# Altium project BerndoKeyboard-Switchboard.PrjPcb (part 3 of 4)

## Sheet [04] - Keyboard Matrix 2.SchDoc: Keyboard Matrix 2
size A3; Date: N.A.; ApprovedBy: N.A.; CheckedBy: N.A.; Author: N.A.; CompanyName: Johannes Berndorfer; DrawnBy: JBE; Organization: N.A.; Address1: Konrad Grefe Gasse 22; Address2: 1230 Wien; Address3: AUSTRIA; Address4: N.A.; DocumentNumber: 4; Revision: A; SheetNumber: 4; SheetTotal: 8; ProjectTitle: Berndo Keyboard Switchboard PCB; Reviewer: -; Time: N.A.; ImagePath: N.A.; Application_BuildNumber: N.A.
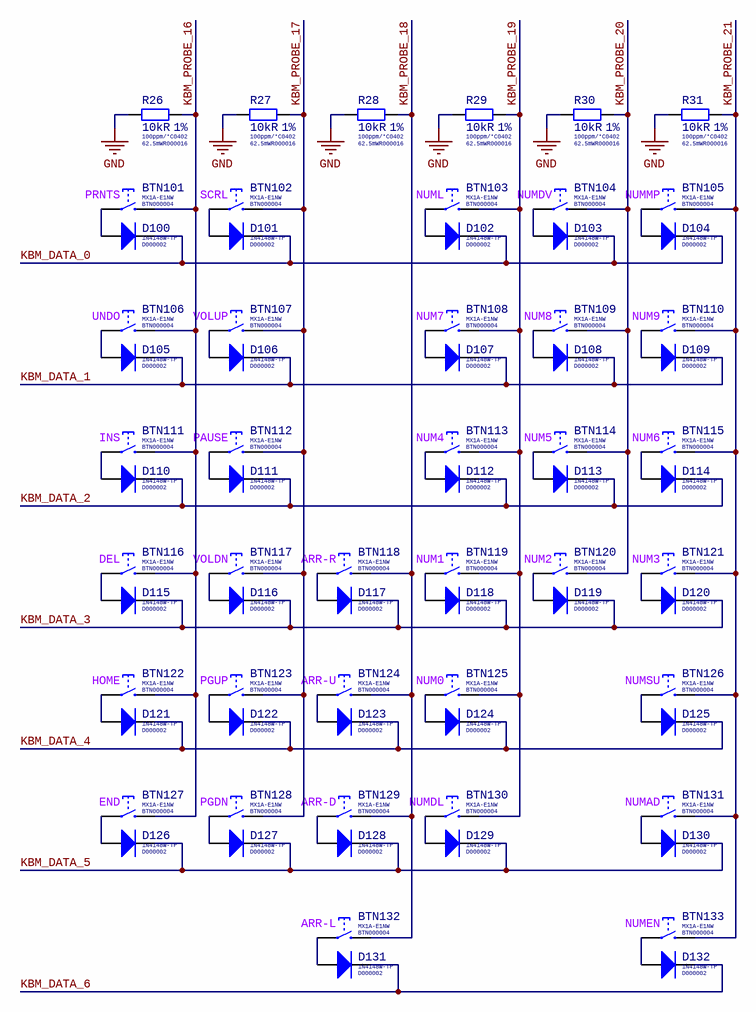
[diagram p3: [04] - Keyboard Matrix 2.SchDoc]

### Parts
BTN101  MX1A-E1NW  Internal Part Number: BTN000004  Key Function: PRNTS  [BTN-THT-MX-CHERRY]
BTN102  MX1A-E1NW  Internal Part Number: BTN000004  Key Function: SCRL  [BTN-THT-MX-CHERRY]
BTN103  MX1A-E1NW  Internal Part Number: BTN000004  Key Function: NUML  [BTN-THT-MX-CHERRY]
BTN104  MX1A-E1NW  Internal Part Number: BTN000004  Key Function: NUMDV  [BTN-THT-MX-CHERRY]
BTN105  MX1A-E1NW  Internal Part Number: BTN000004  Key Function: NUMMP  [BTN-THT-MX-CHERRY]
BTN106  MX1A-E1NW  Internal Part Number: BTN000004  Key Function: UNDO  [BTN-THT-MX-CHERRY]
BTN107  MX1A-E1NW  Internal Part Number: BTN000004  Key Function: VOLUP  [BTN-THT-MX-CHERRY]
BTN108  MX1A-E1NW  Internal Part Number: BTN000004  Key Function: NUM7  [BTN-THT-MX-CHERRY]
BTN109  MX1A-E1NW  Internal Part Number: BTN000004  Key Function: NUM8  [BTN-THT-MX-CHERRY]
BTN110  MX1A-E1NW  Internal Part Number: BTN000004  Key Function: NUM9  [BTN-THT-MX-CHERRY]
BTN111  MX1A-E1NW  Internal Part Number: BTN000004  Key Function: INS  [BTN-THT-MX-CHERRY]
BTN112  MX1A-E1NW  Internal Part Number: BTN000004  Key Function: PAUSE  [BTN-THT-MX-CHERRY]
BTN113  MX1A-E1NW  Internal Part Number: BTN000004  Key Function: NUM4  [BTN-THT-MX-CHERRY]
BTN114  MX1A-E1NW  Internal Part Number: BTN000004  Key Function: NUM5  [BTN-THT-MX-CHERRY]
BTN115  MX1A-E1NW  Internal Part Number: BTN000004  Key Function: NUM6  [BTN-THT-MX-CHERRY]
BTN116  MX1A-E1NW  Internal Part Number: BTN000004  Key Function: DEL  [BTN-THT-MX-CHERRY]
BTN117  MX1A-E1NW  Internal Part Number: BTN000004  Key Function: VOLDN  [BTN-THT-MX-CHERRY]
BTN118  MX1A-E1NW  Internal Part Number: BTN000004  Key Function: ARR-R  [BTN-THT-MX-CHERRY]
BTN119  MX1A-E1NW  Internal Part Number: BTN000004  Key Function: NUM1  [BTN-THT-MX-CHERRY]
BTN120  MX1A-E1NW  Internal Part Number: BTN000004  Key Function: NUM2  [BTN-THT-MX-CHERRY]
BTN121  MX1A-E1NW  Internal Part Number: BTN000004  Key Function: NUM3  [BTN-THT-MX-CHERRY]
BTN122  MX1A-E1NW  Internal Part Number: BTN000004  Key Function: HOME  [BTN-THT-MX-CHERRY]
BTN123  MX1A-E1NW  Internal Part Number: BTN000004  Key Function: PGUP  [BTN-THT-MX-CHERRY]
BTN124  MX1A-E1NW  Internal Part Number: BTN000004  Key Function: ARR-U  [BTN-THT-MX-CHERRY]
BTN125  MX1A-E1NW  Internal Part Number: BTN000004  Key Function: NUM0  [BTN-THT-MX-CHERRY]
BTN126  MX1A-E1NW  Internal Part Number: BTN000004  Key Function: NUMSU  [BTN-THT-MX-CHERRY]
BTN127  MX1A-E1NW  Internal Part Number: BTN000004  Key Function: END  [BTN-THT-MX-CHERRY]
BTN128  MX1A-E1NW  Internal Part Number: BTN000004  Key Function: PGDN  [BTN-THT-MX-CHERRY]
BTN129  MX1A-E1NW  Internal Part Number: BTN000004  Key Function: ARR-D  [BTN-THT-MX-CHERRY]
BTN130  MX1A-E1NW  Internal Part Number: BTN000004  Key Function: NUMDL  [BTN-THT-MX-CHERRY]
BTN131  MX1A-E1NW  Internal Part Number: BTN000004  Key Function: NUMAD  [BTN-THT-MX-CHERRY]
BTN132  MX1A-E1NW  Internal Part Number: BTN000004  Key Function: ARR-L  [BTN-THT-MX-CHERRY]
BTN133  MX1A-E1NW  Internal Part Number: BTN000004  Key Function: NUMEN  [BTN-THT-MX-CHERRY]
D100  1N4148W-TP  Internal Part Number: D000002  [D-SMD-SOD-123-MICRO-COMMERCIAL-COMPONENTS]
D101  1N4148W-TP  Internal Part Number: D000002  [D-SMD-SOD-123-MICRO-COMMERCIAL-COMPONENTS]
D102  1N4148W-TP  Internal Part Number: D000002  [D-SMD-SOD-123-MICRO-COMMERCIAL-COMPONENTS]
D103  1N4148W-TP  Internal Part Number: D000002  [D-SMD-SOD-123-MICRO-COMMERCIAL-COMPONENTS]
D104  1N4148W-TP  Internal Part Number: D000002  [D-SMD-SOD-123-MICRO-COMMERCIAL-COMPONENTS]
D105  1N4148W-TP  Internal Part Number: D000002  [D-SMD-SOD-123-MICRO-COMMERCIAL-COMPONENTS]
D106  1N4148W-TP  Internal Part Number: D000002  [D-SMD-SOD-123-MICRO-COMMERCIAL-COMPONENTS]
D107  1N4148W-TP  Internal Part Number: D000002  [D-SMD-SOD-123-MICRO-COMMERCIAL-COMPONENTS]
D108  1N4148W-TP  Internal Part Number: D000002  [D-SMD-SOD-123-MICRO-COMMERCIAL-COMPONENTS]
D109  1N4148W-TP  Internal Part Number: D000002  [D-SMD-SOD-123-MICRO-COMMERCIAL-COMPONENTS]
D110  1N4148W-TP  Internal Part Number: D000002  [D-SMD-SOD-123-MICRO-COMMERCIAL-COMPONENTS]
D111  1N4148W-TP  Internal Part Number: D000002  [D-SMD-SOD-123-MICRO-COMMERCIAL-COMPONENTS]
D112  1N4148W-TP  Internal Part Number: D000002  [D-SMD-SOD-123-MICRO-COMMERCIAL-COMPONENTS]
D113  1N4148W-TP  Internal Part Number: D000002  [D-SMD-SOD-123-MICRO-COMMERCIAL-COMPONENTS]
D114  1N4148W-TP  Internal Part Number: D000002  [D-SMD-SOD-123-MICRO-COMMERCIAL-COMPONENTS]
D115  1N4148W-TP  Internal Part Number: D000002  [D-SMD-SOD-123-MICRO-COMMERCIAL-COMPONENTS]
D116  1N4148W-TP  Internal Part Number: D000002  [D-SMD-SOD-123-MICRO-COMMERCIAL-COMPONENTS]
D117  1N4148W-TP  Internal Part Number: D000002  [D-SMD-SOD-123-MICRO-COMMERCIAL-COMPONENTS]
D118  1N4148W-TP  Internal Part Number: D000002  [D-SMD-SOD-123-MICRO-COMMERCIAL-COMPONENTS]
D119  1N4148W-TP  Internal Part Number: D000002  [D-SMD-SOD-123-MICRO-COMMERCIAL-COMPONENTS]
D120  1N4148W-TP  Internal Part Number: D000002  [D-SMD-SOD-123-MICRO-COMMERCIAL-COMPONENTS]
D121  1N4148W-TP  Internal Part Number: D000002  [D-SMD-SOD-123-MICRO-COMMERCIAL-COMPONENTS]
D122  1N4148W-TP  Internal Part Number: D000002  [D-SMD-SOD-123-MICRO-COMMERCIAL-COMPONENTS]
D123  1N4148W-TP  Internal Part Number: D000002  [D-SMD-SOD-123-MICRO-COMMERCIAL-COMPONENTS]
D124  1N4148W-TP  Internal Part Number: D000002  [D-SMD-SOD-123-MICRO-COMMERCIAL-COMPONENTS]
D125  1N4148W-TP  Internal Part Number: D000002  [D-SMD-SOD-123-MICRO-COMMERCIAL-COMPONENTS]
D126  1N4148W-TP  Internal Part Number: D000002  [D-SMD-SOD-123-MICRO-COMMERCIAL-COMPONENTS]
D127  1N4148W-TP  Internal Part Number: D000002  [D-SMD-SOD-123-MICRO-COMMERCIAL-COMPONENTS]
D128  1N4148W-TP  Internal Part Number: D000002  [D-SMD-SOD-123-MICRO-COMMERCIAL-COMPONENTS]
D129  1N4148W-TP  Internal Part Number: D000002  [D-SMD-SOD-123-MICRO-COMMERCIAL-COMPONENTS]
D130  1N4148W-TP  Internal Part Number: D000002  [D-SMD-SOD-123-MICRO-COMMERCIAL-COMPONENTS]
D131  1N4148W-TP  Internal Part Number: D000002  [D-SMD-SOD-123-MICRO-COMMERCIAL-COMPONENTS]
D132  1N4148W-TP  Internal Part Number: D000002  [D-SMD-SOD-123-MICRO-COMMERCIAL-COMPONENTS]
R26  Tolerance: 1%  Temperature Coefficient: 100ppm/°C  Resistance: 10kR  Power Rating: 62.5mW  Case Code (Imperial): 0402  Internal Part Number: R000016  [RES-SMD-0402-0.4MM-IPC-MED]  (hidden comment: 10kR 1%)
R27  Tolerance: 1%  Temperature Coefficient: 100ppm/°C  Resistance: 10kR  Power Rating: 62.5mW  Case Code (Imperial): 0402  Internal Part Number: R000016  [RES-SMD-0402-0.4MM-IPC-MED]  (hidden comment: 10kR 1%)
R28  Tolerance: 1%  Temperature Coefficient: 100ppm/°C  Resistance: 10kR  Power Rating: 62.5mW  Case Code (Imperial): 0402  Internal Part Number: R000016  [RES-SMD-0402-0.4MM-IPC-MED]  (hidden comment: 10kR 1%)
R29  Tolerance: 1%  Temperature Coefficient: 100ppm/°C  Resistance: 10kR  Power Rating: 62.5mW  Case Code (Imperial): 0402  Internal Part Number: R000016  [RES-SMD-0402-0.4MM-IPC-MED]  (hidden comment: 10kR 1%)
R30  Tolerance: 1%  Temperature Coefficient: 100ppm/°C  Resistance: 10kR  Power Rating: 62.5mW  Case Code (Imperial): 0402  Internal Part Number: R000016  [RES-SMD-0402-0.4MM-IPC-MED]  (hidden comment: 10kR 1%)
R31  Tolerance: 1%  Temperature Coefficient: 100ppm/°C  Resistance: 10kR  Power Rating: 62.5mW  Case Code (Imperial): 0402  Internal Part Number: R000016  [RES-SMD-0402-0.4MM-IPC-MED]  (hidden comment: 10kR 1%)

### Nets
GND: R26.1 R27.1 R28.1 R29.1 R30.1 R31.1
KBM_DATA_0: D100.1 D101.1 D102.1 D103.1 D104.1
KBM_DATA_1: D105.1 D106.1 D107.1 D108.1 D109.1
KBM_DATA_2: D110.1 D111.1 D112.1 D113.1 D114.1
KBM_DATA_3: D115.1 D116.1 D117.1 D118.1 D119.1 D120.1
KBM_DATA_4: D121.1 D122.1 D123.1 D124.1 D125.1
KBM_DATA_5: D126.1 D127.1 D128.1 D129.1 D130.1
KBM_DATA_6: D131.1 D132.1
KBM_PROBE_16: BTN101.2 BTN106.2 BTN111.2 BTN116.2 BTN122.2 BTN127.2 R26.2
KBM_PROBE_17: BTN102.2 BTN107.2 BTN112.2 BTN117.2 BTN123.2 BTN128.2 R27.2
KBM_PROBE_18: BTN118.2 BTN124.2 BTN129.2 BTN132.2 R28.2
KBM_PROBE_19: BTN103.2 BTN108.2 BTN113.2 BTN119.2 BTN125.2 BTN130.2 R29.2
KBM_PROBE_20: BTN104.2 BTN109.2 BTN114.2 BTN120.2 R30.2
KBM_PROBE_21: BTN105.2 BTN110.2 BTN115.2 BTN121.2 BTN126.2 BTN131.2 BTN133.2 R31.2
NetBTN101_1: BTN101.1 D100.2
NetBTN102_1: BTN102.1 D101.2
NetBTN103_1: BTN103.1 D102.2
NetBTN104_1: BTN104.1 D103.2
NetBTN105_1: BTN105.1 D104.2
NetBTN106_1: BTN106.1 D105.2
NetBTN107_1: BTN107.1 D106.2
NetBTN108_1: BTN108.1 D107.2
NetBTN109_1: BTN109.1 D108.2
NetBTN110_1: BTN110.1 D109.2
NetBTN111_1: BTN111.1 D110.2
NetBTN112_1: BTN112.1 D111.2
NetBTN113_1: BTN113.1 D112.2
NetBTN114_1: BTN114.1 D113.2
NetBTN115_1: BTN115.1 D114.2
NetBTN116_1: BTN116.1 D115.2
NetBTN117_1: BTN117.1 D116.2
NetBTN118_1: BTN118.1 D117.2
NetBTN119_1: BTN119.1 D118.2
NetBTN120_1: BTN120.1 D119.2
NetBTN121_1: BTN121.1 D120.2
NetBTN122_1: BTN122.1 D121.2
NetBTN123_1: BTN123.1 D122.2
NetBTN124_1: BTN124.1 D123.2
NetBTN125_1: BTN125.1 D124.2
NetBTN126_1: BTN126.1 D125.2
NetBTN127_1: BTN127.1 D126.2
NetBTN128_1: BTN128.1 D127.2
NetBTN129_1: BTN129.1 D128.2
NetBTN130_1: BTN130.1 D129.2
NetBTN131_1: BTN131.1 D130.2
NetBTN132_1: BTN132.1 D131.2
NetBTN133_1: BTN133.1 D132.2

### Notes on the sheet
- Title:
- Project:
- Document Nr.:
- Revision:
- Date:
- Drawn By:
- Time:
- Reviewed By:
- Sheet
- of
- Size:
- A3
- Variant:
- File:

### Library data of the parts
BTN101-BTN133 = MX1A-E1NW: BTN CHERRY MX BLUE SPST-NO 12V 10mA; Mechanical Life: 20000000Cycles; Throw Configuration: SPST; Contact Resistance: 200mR; Operating Force: 0.5N; Switch Function: Off-Mom; Row Spacing: 2.54mm; Actuator Length: 3.6mm; Supplier 1: Digi-Key; Manufacturer: Cherry; Manufacturer Part Number: MX1A-E1NW; Stock 1: 3965; Pricing 1: 1 = 0,90000, 10 = 0,84000, 25 = 0,80000, 50 = 0,76000, 100 = 0,74000, 250 = 0,72000, 500 = 0,68000, 1000 = 0,64000, 5000 = 0,54000 (USD); RoHS: Yes; Mount: Through Hole; Contact Plating: Gold; Contact Material: Gold,Silver; Number of Terminals: 2; Housing Material: Thermoplastic; Min Operating Temperature: -10°C; Max Operating Temperature: 70°C; Voltage Rating (AC): 12V; Voltage Rating (DC): 12V; Packaging: Bulk; Current Rating: 10mA; Max Voltage Rating (AC): 12V; Max Voltage Rating (DC): 12V; Max Current Rating: 10mA; Package Quantity: 1000; Termination: PC Pin; Electrical Life: 20000000Cycles; Orientation: Straight; Contact Current Rating: 10mA; Length: 15.6mm; Terminal Pitch: 6.35mm; Width: 15.6mm; Lead Free: Lead Free; Flammability Rating: UL94 HB; ComponentLink1URL: https://datasheet.ciiva.com/2869/mx20series-2869568.pdf?src-supplier=Digi-Key; ComponentLink1Description: https://datasheet.ciiva.com/2869/mx20series-2869568.pdf?src-supplier=Digi-Key; ComponentLink2URL: https://datasheet.ciiva.com/5259/mx-cat-216303-5259204.pdf?src-supplier=Mouser; ComponentLink2Description: https://datasheet.ciiva.com/5259/mx-cat-216303-5259204.pdf?src-supplier=Mouser; Supplier Part Number 1: CH197-ND
D100-D132 = 1N4148W-TP: DIODE GEN-PURP 100V 150mA 1V25@150mA SMD SOD-23; Manufacturer: MCC; Max Surge Current: 2A; Forward Voltage: 1V; Recovery Time: 4ns; Max Reverse Leakage Current: 5uA; Power Dissipation: 400mW; Max Forward Surge Current (Ifsm): 1A; Element Configuration: Single; Polarity: Standard; Capacitance: 4pF; Supplier 1: Digi-Key; Manufacturer Part Number: 1N4148W-TP; Stock 1: 1077433; Pricing 1: 1 = 0,13000, 10 = 0,11900, 100 = 0,06480, 500 = 0,03986, 1000 = 0,02718 (USD); RoHS: Yes; Mount: Surface Mount; Number of Pins: 2; Min Operating Temperature: -65°C; Max Operating Temperature: 150°C; Packaging: Tape and Reel; Forward Current: 150mA; Package Quantity: 3000; Average Rectified Current: 150mA; Reverse Recovery Time: 4ns; Max Repetitive Reverse Voltage (Vrrm): 100V; Peak Non-Repetitive Surge Current: 2A; Voltage Rating (DC): 100V; Current Rating: 150mA; Output Current: 150mA; Max Reverse Voltage (DC): 100V; Length: 2.85mm; Height: 1.2mm; Width: 1.8mm; Radiation Hardening: No; REACH SVHC: Unknown; Lead Free: Lead Free; ComponentLink1URL: https://datasheet.ciiva.com/1243/1684829-1243908.pdf?src-supplier=Newark; ComponentLink1Description: https://datasheet.ciiva.com/1243/1684829-1243908.pdf?src-supplier=Newark; ComponentLink2URL: https://datasheet.ciiva.com/16836/1n4148wsod123-16836277.pdf?src-supplier=Future+Electronics; ComponentLink2Description: https://datasheet.ciiva.com/16836/1n4148wsod123-16836277.pdf?src-supplier=Future+Electronics; ComponentLink3URL: https://datasheet.ciiva.com/4435/1n4148wsod123-48460-4435223.pdf?src-supplier=Mouser; ComponentLink3Description: https://datasheet.ciiva.com/4435/1n4148wsod123-48460-4435223.pdf?src-supplier=Mouser; ComponentLink4URL: https://datasheet.ciiva.com/14557/70055519-14557767.pdf?src-supplier=Allied+Electronics; ComponentLink4Description: https://datasheet.ciiva.com/14557/70055519-14557767.pdf?src-supplier=Allied+Electronics; ComponentLink5URL: https://datasheet.ciiva.com/911/1n4148wsod123-911676.pdf?src-supplier=Digi-Key; ComponentLink5Description: https://datasheet.ciiva.com/911/1n4148wsod123-911676.pdf?src-supplier=Digi-Key; ComponentLink6URL: https://datasheet.ciiva.com/7622/1684829-7622556.pdf?src-supplier=Element14; ComponentLink6Description: https://datasheet.ciiva.com/7622/1684829-7622556.pdf?src-supplier=Element14; ComponentLink7URL: https://datasheet.ciiva.com/911/1n4148wsod123-911677.pdf?src-supplier=Digi-Key; ComponentLink7Description: https://datasheet.ciiva.com/911/1n4148wsod123-911677.pdf?src-supplier=Digi-Key; ComponentLink8URL: https://datasheet.ciiva.com/911/1n4148wsod123-911678.pdf?src-supplier=Digi-Key; ComponentLink8Description: https://datasheet.ciiva.com/911/1n4148wsod123-911678.pdf?src-supplier=Digi-Key; ComponentLink9URL: https://datasheet.ciiva.com/22747/1684829-22747439.pdf?src-supplier=Element14; ComponentLink9Description: https://datasheet.ciiva.com/22747/1684829-22747439.pdf?src-supplier=Element14; Supplier Part Number 1: 1N4148WTPMSCT-ND
R26-R31 = RC0402FR-0710KL: RES 10K 1% 1/16W SMD 0402 YAEGO; Manufacturer: Yageo; Voltage Rating: 50V; Manufacturer Part Number: RC0402FR-0710KL; RoHS: Yes; Case/Package: 0402; Number of Pins: 2; Case Code (Metric): 1005; Min Operating Temperature: -55°C; Max Operating Temperature: 155°C; Packaging: Tape and Reel; Composition: Thick Film; Voltage Rating (DC): 50V; Termination: SMD/SMT; Military Standard: Not; Working Voltage: 50V; Number of Terminations: 2; Length: 1mm; Height: 0.32mm; Width: 0.5mm; Depth: 0.5mm; Lead Pitch: 0.2mm; REACH SVHC: No SVHC; Lead Free: Lead Free; ComponentLink1URL: https://datasheet.ciiva.com/7660/38568-7660787.pdf?src-supplier=Element14; ComponentLink1Description: https://datasheet.ciiva.com/7660/38568-7660787.pdf?src-supplier=Element14; ComponentLink2URL: https://datasheet.ciiva.com/7849/1784430-7849813.pdf?src-supplier=Element14; ComponentLink2Description: https://datasheet.ciiva.com/7849/1784430-7849813.pdf?src-supplier=Element14; ComponentLink3URL: https://datasheet.ciiva.com/7849/1686128-7849814.pdf?src-supplier=Element14; ComponentLink3Description: https://datasheet.ciiva.com/7849/1686128-7849814.pdf?src-supplier=Element14; ComponentLink4URL: https://datasheet.ciiva.com/7849/1784430-7849815.pdf?src-supplier=Element14; ComponentLink4Description: https://datasheet.ciiva.com/7849/1784430-7849815.pdf?src-supplier=Element14; ComponentLink5URL: https://datasheet.ciiva.com/22747/1018594-22747512.pdf?src-supplier=Element14; ComponentLink5Description: https://datasheet.ciiva.com/22747/1018594-22747512.pdf?src-supplier=Element14; ComponentLink6URL: https://datasheet.ciiva.com/12667/pyu-rc0402-51-rohs-l-6-r-12667067.pdf?src-supplier=Mouser; ComponentLink6Description: https://datasheet.ciiva.com/12667/pyu-rc0402-51-rohs-l-6-r-12667067.pdf?src-supplier=Mouser; ComponentLink7URL: https://datasheet.ciiva.com/7983/1018594-7983486.pdf?src-supplier=Element14; ComponentLink7Description: https://datasheet.ciiva.com/7983/1018594-7983486.pdf?src-supplier=Element14; Package Quantity: 10000; ComponentLink8URL: https://datasheet.ciiva.com/11819/0900766b80c66297-11819487.pdf?src-supplier=RSComponents; ComponentLink8Description: https://datasheet.ciiva.com/11819/0900766b80c66297-11819487.pdf?src-supplier=RSComponents; ComponentLink9URL: https://datasheet.ciiva.com/15189/getdatasheetpartid-329253-15189431.pdf?src-supplier=Verical; ComponentLink9Description: https://datasheet.ciiva.com/15189/getdatasheetpartid-329253-15189431.pdf?src-supplier=Verical; ComponentLink10URL: https://datasheet.ciiva.com/24070/pyu-rc0402-51-rohs-l-6-r-8721-24070077.pdf?src-supplier=Mouser; ComponentLink10Description: https://datasheet.ciiva.com/24070/pyu-rc0402-51-rohs-l-6-r-8721-24070077.pdf?src-supplier=Mouser; ComponentLink11URL: https://datasheet.ciiva.com/7849/1018594-7849966.pdf?src-supplier=Element14; ComponentLink11Description: https://datasheet.ciiva.com/7849/1018594-7849966.pdf?src-supplier=Element14; ComponentLink12URL: https://datasheet.ciiva.com/7849/1018594-7849967.pdf?src-supplier=Element14; ComponentLink12Description: https://datasheet.ciiva.com/7849/1018594-7849967.pdf?src-supplier=Element14; ComponentLink13URL: https://datasheet.ciiva.com/17070/pyu-rc0402-51-rohs-l-6-r-17070335.pdf?src-supplier=Future+Electronics; ComponentLink13Description: https://datasheet.ciiva.com/17070/pyu-rc0402-51-rohs-l-6-r-17070335.pdf?src-supplier=Future+Electronics; Supplier 1: Digi-Key; Stock 1: 86154015; Pricing 1: 1 = 0,10000, 10 = 0,01600, 100 = 0,00670, 1000 = 0,00301, 2500 = 0,00261, 5000 = 0,00215 (USD); Supplier Part Number 1: 311-10.0KLRCT-ND

## Sheet [05] - Probe Line IO Expanders.SchDoc: Probe Line IO Expanders
size A3; Date: N.A.; ApprovedBy: N.A.; CheckedBy: N.A.; Author: N.A.; CompanyName: Johannes Berndorfer; DrawnBy: JBE; Organization: N.A.; Address1: Konrad Grefe Gasse 22; Address2: 1230 Wien; Address3: AUSTRIA; Address4: N.A.; DocumentNumber: 5; Revision: A; SheetNumber: 5; SheetTotal: 8; ProjectTitle: Berndo Keyboard Switchboard PCB; Reviewer: -; Time: N.A.; ImagePath: N.A.; Application_BuildNumber: N.A.
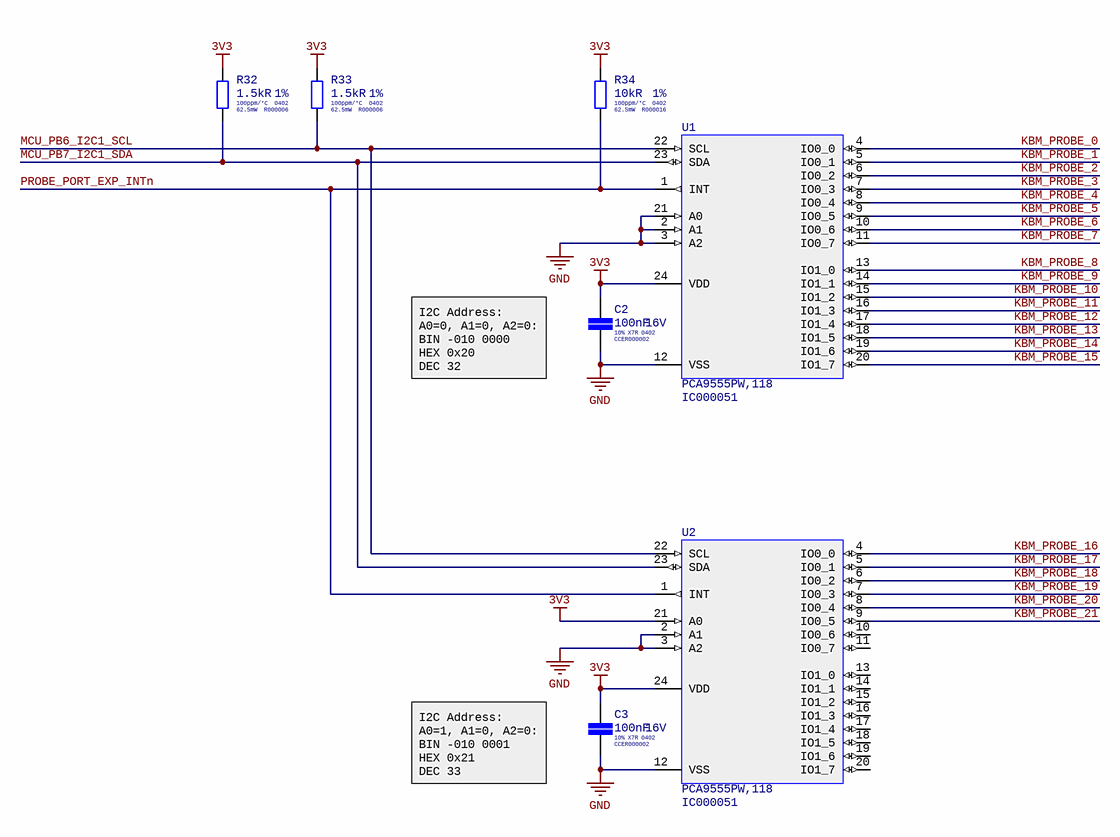
[diagram p4: [05] - Probe Line IO Expanders.SchDoc]

### Parts
C2  Tolerance: 10%  Internal Part Number: CCER000002  Voltage Rating (DC): 16V  Dielectric: X7R  Case/Package: 0402  Capacitance: 100nF  [CAP-SMD-0402-0.55MM-IPC-MED]  (hidden comment: 100nF 16V)
C3  Tolerance: 10%  Internal Part Number: CCER000002  Voltage Rating (DC): 16V  Dielectric: X7R  Case/Package: 0402  Capacitance: 100nF  [CAP-SMD-0402-0.55MM-IPC-MED]  (hidden comment: 100nF 16V)
R32  Temperature Coefficient: 100ppm/°C  Tolerance: 1%  Resistance: 1.5kR  Max Power Dissipation: 62.5mW  Case/Package: 0402  Internal Part Number: R000006  [RES-SMD-0402-0.4MM-IPC-MED]  (hidden comment: 1.5kR 1%)
R33  Temperature Coefficient: 100ppm/°C  Tolerance: 1%  Resistance: 1.5kR  Max Power Dissipation: 62.5mW  Case/Package: 0402  Internal Part Number: R000006  [RES-SMD-0402-0.4MM-IPC-MED]  (hidden comment: 1.5kR 1%)
R34  Tolerance: 1%  Temperature Coefficient: 100ppm/°C  Resistance: 10kR  Power Rating: 62.5mW  Case Code (Imperial): 0402  Internal Part Number: R000016  [RES-SMD-0402-0.4MM-IPC-MED]  (hidden comment: 10kR 1%)
U1  PCA9555PW,118  Internal Part Number: IC000051  [TSSOP-24-H1.1MM-P0.65MM-NXP]
U2  PCA9555PW,118  Internal Part Number: IC000051  [TSSOP-24-H1.1MM-P0.65MM-NXP]

### Nets
3V3: C2.1 C3.1 R32.1 R33.1 R34.1 U1.24(VDD) U2.21(A0) U2.24(VDD)
GND: C2.2 C3.2 U1.2(A1) U1.3(A2) U1.12(VSS) U1.21(A0) U2.2(A1) U2.3(A2) U2.12(VSS)
KBM_PROBE_0: U1.4(IO0_0)
KBM_PROBE_1: U1.5(IO0_1)
KBM_PROBE_2: U1.6(IO0_2)
KBM_PROBE_3: U1.7(IO0_3)
KBM_PROBE_4: U1.8(IO0_4)
KBM_PROBE_5: U1.9(IO0_5)
KBM_PROBE_6: U1.10(IO0_6)
KBM_PROBE_7: U1.11(IO0_7)
KBM_PROBE_8: U1.13(IO1_0)
KBM_PROBE_9: U1.14(IO1_1)
KBM_PROBE_10: U1.15(IO1_2)
KBM_PROBE_11: U1.16(IO1_3)
KBM_PROBE_12: U1.17(IO1_4)
KBM_PROBE_13: U1.18(IO1_5)
KBM_PROBE_14: U1.19(IO1_6)
KBM_PROBE_15: U1.20(IO1_7)
KBM_PROBE_16: U2.4(IO0_0)
KBM_PROBE_17: U2.5(IO0_1)
KBM_PROBE_18: U2.6(IO0_2)
KBM_PROBE_19: U2.7(IO0_3)
KBM_PROBE_20: U2.8(IO0_4)
KBM_PROBE_21: U2.9(IO0_5)
MCU_PB6_I2C1_SCL: R33.2 U1.22(SCL) U2.22(SCL)
MCU_PB7_I2C1_SDA: R32.2 U1.23(SDA) U2.23(SDA)
PROBE_PORT_EXP_INTn: R34.2 U1.1(INT) U2.1(INT)

Not connected (* = marked no-connect by the designer): U2 10(IO0_6) 11(IO0_7) 13(IO1_0) 14(IO1_1) 15(IO1_2) 16(IO1_3) 17(IO1_4) 18(IO1_5) 19(IO1_6) 20(IO1_7)

### Notes on the sheet
- I2C Address:
  A0=0, A1=0, A2=0:
  BIN -010 0000
  HEX 0x20
  DEC 32
- I2C Address:
  A0=1, A1=0, A2=0:
  BIN -010 0001
  HEX 0x21
  DEC 33
- Title:
- Project:
- Document Nr.:
- Revision:
- Date:
- Drawn By:
- Time:
- Reviewed By:
- Sheet
- of
- Size:
- A3
- Variant:
- File:

### Library data of the parts
C2 C3 = CL05B104KO5NNNC: CAP CER 100N 16V X7R 10% SMD 0402 125C SAMSUNG; Material: Ceramic; Supplier 1: Digi-Key; Manufacturer 1: Samsung; Manufacturer Part Number 1: CL05B104KO5NNNC; Stock 1: 53930414; Pricing 1: 1=0,10000, 10=0,02400, 100=0,01070, 500=0,00766, 1000=0,00602, 2500=0,00548, 5000=0,00504 (USD); RoHS: Yes; Mount: Surface Mount; Case Code (Metric): 1005; Case Code (Imperial): 0402; Contact Plating: Tin; Min Operating Temperature: -55°C; Max Operating Temperature: 125°C; Package Quantity: 1; Packaging: Tape and Reel; Voltage Rating: 16V; Voltage: 16V; Length: 1mm; Height: 0.5mm; Width: 0.02inch; Thickness: 0.022inch; Depth: 0.5mm; Radiation Hardening: No; Lead Free: Lead Free; ComponentLink1URL: https://datasheet.ciiva.com/26920/getdatasheetpartid-359683-26920169.pdf?src-supplier=Verical; ComponentLink1Description: https://datasheet.ciiva.com/26920/getdatasheetpartid-359683-26920169.pdf?src-supplier=Verical; ComponentLink2URL: https://datasheet.ciiva.com/29198/458718-da-01-en-vs-kondensator-0402-29198423.pdf?src-supplier=Conrad; ComponentLink2Description: https://datasheet.ciiva.com/29198/458718-da-01-en-vs-kondensator-0402-29198423.pdf?src-supplier=Conrad; ComponentLink3URL: https://datasheet.ciiva.com/16208/cl05b104kq5nnnc-16208343.pdf?src-supplier=Future+Electronics; ComponentLink3Description: https://datasheet.ciiva.com/16208/cl05b104kq5nnnc-16208343.pdf?src-supplier=Future+Electronics; ComponentLink4URL: https://datasheet.ciiva.com/26309/mlcc-catalogdownload2013-eng-26309003.pdf?src-supplier=Distrelec; ComponentLink4Description: https://datasheet.ciiva.com/26309/mlcc-catalogdownload2013-eng-26309003.pdf?src-supplier=Distrelec; Supplier Part Number 1: 1276-1001-6-ND
R32 R33 = RC0402FR-071K5L: RES 1K5 1% 1/16W SMD 0402 YAEGO; Manufacturer: Yageo; Voltage Rating: 50V; Supplier 1: Digi-Key; Manufacturer Part Number: RC0402FR-071K5L; Stock 1: 9091318; Pricing 1: 1 = 0,10000, 10 = 0,01600, 100 = 0,00640, 1000 = 0,00286, 2500 = 0,00248, 5000 = 0,00205 (USD); RoHS: Yes; Case Code (Metric): 1005; Case Code (Imperial): 0402; Min Operating Temperature: -55°C; Max Operating Temperature: 155°C; Package Quantity: 1; Power Rating: 62.5mW; Packaging: Tape and Reel; Composition: Thick Film; Number of Terminations: 2; Termination: SMD/SMT; Military Standard: Not; Features: Moisture Resistant; Length: 1mm; Height: 0.016inch; Width: 0.02inch; Depth: 0.5mm; REACH SVHC: No SVHC; Lead Free: Lead Free; ComponentLink1URL: https://datasheet.ciiva.com/11808/0900766b80c66297-11808238.pdf?src-supplier=RSComponents; ComponentLink1Description: https://datasheet.ciiva.com/11808/0900766b80c66297-11808238.pdf?src-supplier=RSComponents; ComponentLink2URL: https://datasheet.ciiva.com/2453/pyu-r-int-thick-7-2453440.pdf?src-supplier=Digi-Key; ComponentLink2Description: https://datasheet.ciiva.com/2453/pyu-r-int-thick-7-2453440.pdf?src-supplier=Digi-Key; ComponentLink3URL: https://datasheet.ciiva.com/2453/pyu-r-int-thick-7-2453441.pdf?src-supplier=Digi-Key; ComponentLink3Description: https://datasheet.ciiva.com/2453/pyu-r-int-thick-7-2453441.pdf?src-supplier=Digi-Key; ComponentLink4URL: https://datasheet.ciiva.com/46394/1018594-46394950.pdf?src-supplier=Element14; ComponentLink4Description: https://datasheet.ciiva.com/46394/1018594-46394950.pdf?src-supplier=Element14; ComponentLink5URL: https://datasheet.ciiva.com/7849/1018594-7849864.pdf?src-supplier=Element14; ComponentLink5Description: https://datasheet.ciiva.com/7849/1018594-7849864.pdf?src-supplier=Element14; ComponentLink6URL: https://datasheet.ciiva.com/15189/getdatasheetpartid-323992-15189370.pdf?src-supplier=Verical; ComponentLink6Description: https://datasheet.ciiva.com/15189/getdatasheetpartid-323992-15189370.pdf?src-supplier=Verical; ComponentLink7URL: https://datasheet.ciiva.com/7849/1018594-7849863.pdf?src-supplier=Element14; ComponentLink7Description: https://datasheet.ciiva.com/7849/1018594-7849863.pdf?src-supplier=Element14; ComponentLink8URL: https://datasheet.ciiva.com/12558/pyu-rc0402-51-rohs-l-6-r-8721-12558542.pdf?src-supplier=Mouser; ComponentLink8Description: https://datasheet.ciiva.com/12558/pyu-rc0402-51-rohs-l-6-r-8721-12558542.pdf?src-supplier=Mouser; ComponentLink9URL: https://datasheet.ciiva.com/2453/pyu-r-int-thick-7-2453439.pdf?src-supplier=Digi-Key; ComponentLink9Description: https://datasheet.ciiva.com/2453/pyu-r-int-thick-7-2453439.pdf?src-supplier=Digi-Key; Supplier Part Number 1: 311-1.50KLRCT-ND
R34 = RC0402FR-0710KL: as R26 on sheet [04] - Keyboard Matrix 2; Manufacturer Part Number: RC0402FR-0710KL; RoHS: Yes; Case/Package: 0402; Number of Pins: 2; Case Code (Metric): 1005; Min Operating Temperature: -55°C; Max Operating Temperature: 155°C; Packaging: Tape and Reel; Composition: Thick Film; Voltage Rating (DC): 50V; Termination: SMD/SMT; Military Standard: Not; Working Voltage: 50V; Number of Terminations: 2; Length: 1mm; Height: 0.32mm; Width: 0.5mm; Depth: 0.5mm; Lead Pitch: 0.2mm; REACH SVHC: No SVHC; Lead Free: Lead Free; ComponentLink1URL: https://datasheet.ciiva.com/7660/38568-7660787.pdf?src-supplier=Element14; ComponentLink1Description: https://datasheet.ciiva.com/7660/38568-7660787.pdf?src-supplier=Element14; ComponentLink2URL: https://datasheet.ciiva.com/7849/1784430-7849813.pdf?src-supplier=Element14; ComponentLink2Description: https://datasheet.ciiva.com/7849/1784430-7849813.pdf?src-supplier=Element14; ComponentLink3URL: https://datasheet.ciiva.com/7849/1686128-7849814.pdf?src-supplier=Element14; ComponentLink3Description: https://datasheet.ciiva.com/7849/1686128-7849814.pdf?src-supplier=Element14; ComponentLink4URL: https://datasheet.ciiva.com/7849/1784430-7849815.pdf?src-supplier=Element14; ComponentLink4Description: https://datasheet.ciiva.com/7849/1784430-7849815.pdf?src-supplier=Element14; ComponentLink5URL: https://datasheet.ciiva.com/22747/1018594-22747512.pdf?src-supplier=Element14; ComponentLink5Description: https://datasheet.ciiva.com/22747/1018594-22747512.pdf?src-supplier=Element14; ComponentLink6URL: https://datasheet.ciiva.com/12667/pyu-rc0402-51-rohs-l-6-r-12667067.pdf?src-supplier=Mouser; ComponentLink6Description: https://datasheet.ciiva.com/12667/pyu-rc0402-51-rohs-l-6-r-12667067.pdf?src-supplier=Mouser; ComponentLink7URL: https://datasheet.ciiva.com/7983/1018594-7983486.pdf?src-supplier=Element14; ComponentLink7Description: https://datasheet.ciiva.com/7983/1018594-7983486.pdf?src-supplier=Element14; Package Quantity: 10000; ComponentLink8URL: https://datasheet.ciiva.com/11819/0900766b80c66297-11819487.pdf?src-supplier=RSComponents; ComponentLink8Description: https://datasheet.ciiva.com/11819/0900766b80c66297-11819487.pdf?src-supplier=RSComponents; ComponentLink9URL: https://datasheet.ciiva.com/15189/getdatasheetpartid-329253-15189431.pdf?src-supplier=Verical; ComponentLink9Description: https://datasheet.ciiva.com/15189/getdatasheetpartid-329253-15189431.pdf?src-supplier=Verical; ComponentLink10URL: https://datasheet.ciiva.com/24070/pyu-rc0402-51-rohs-l-6-r-8721-24070077.pdf?src-supplier=Mouser; ComponentLink10Description: https://datasheet.ciiva.com/24070/pyu-rc0402-51-rohs-l-6-r-8721-24070077.pdf?src-supplier=Mouser; ComponentLink11URL: https://datasheet.ciiva.com/7849/1018594-7849966.pdf?src-supplier=Element14; ComponentLink11Description: https://datasheet.ciiva.com/7849/1018594-7849966.pdf?src-supplier=Element14; ComponentLink12URL: https://datasheet.ciiva.com/7849/1018594-7849967.pdf?src-supplier=Element14; ComponentLink12Description: https://datasheet.ciiva.com/7849/1018594-7849967.pdf?src-supplier=Element14; ComponentLink13URL: https://datasheet.ciiva.com/17070/pyu-rc0402-51-rohs-l-6-r-17070335.pdf?src-supplier=Future+Electronics; ComponentLink13Description: https://datasheet.ciiva.com/17070/pyu-rc0402-51-rohs-l-6-r-17070335.pdf?src-supplier=Future+Electronics; Supplier 1: Digi-Key; Stock 1: 86154015; Pricing 1: 1 = 0,10000, 10 = 0,01600, 100 = 0,00670, 1000 = 0,00301, 2500 = 0,00261, 5000 = 0,00215 (USD); Supplier Part Number 1: 311-10.0KLRCT-ND
U1 U2 = PCA9555PW,118: IC I/O EXPANDER I2C 16B 24TSSOP; Manufacturer: NXP Semiconductors; Number of I/Os: 16; Interface: I2C,SMBus,Serial; Output Current: 50mA; Nominal Supply Current: 160mA; Min Supply Voltage: 2.3V; Max Supply Voltage: 5.5V; Operating Supply Current: 135uA; Max Power Dissipation: 200mW; Frequency: 400kHz; Output Voltage: 4.1V; Supplier 1: Digi-Key; Manufacturer Part Number: PCA9555PW,118; Stock 1: 10944; Pricing 1: 1 = 1,70000, 10 = 1,52900, 100 = 1,22860, 500 = 1,00940, 1000 = 0,83636 (USD); RoHS: Yes; Mount: Surface Mount; Case/Package: TSSOP; Number of Pins: 24; Min Operating Temperature: -40°C; Max Operating Temperature: 85°C; Packaging: Tape and Reel; Package Quantity: 1; Max Frequency: 400kHz; Radiation Hardening: No; REACH SVHC: No SVHC; Lead Free: Lead Free; ComponentLink1URL: https://datasheet.ciiva.com/15134/getdatasheetpartid-148982-15134333.pdf?src-supplier=Verical; ComponentLink1Description: https://datasheet.ciiva.com/15134/getdatasheetpartid-148982-15134333.pdf?src-supplier=Verical; ComponentLink2URL: https://datasheet.ciiva.com/1780/pca9555-1780068.pdf?src-supplier=Digi-Key; ComponentLink2Description: https://datasheet.ciiva.com/1780/pca9555-1780068.pdf?src-supplier=Digi-Key; ComponentLink3URL: https://datasheet.ciiva.com/1504/1090559-1504901.pdf?src-supplier=Farnell; ComponentLink3Description: https://datasheet.ciiva.com/1504/1090559-1504901.pdf?src-supplier=Farnell; ComponentLink4URL: https://datasheet.ciiva.com/1780/pca9555-1780069.pdf?src-supplier=Digi-Key; ComponentLink4Description: https://datasheet.ciiva.com/1780/pca9555-1780069.pdf?src-supplier=Digi-Key; ComponentLink5URL: https://datasheet.ciiva.com/1780/pca9555-1780070.pdf?src-supplier=Digi-Key; ComponentLink5Description: https://datasheet.ciiva.com/1780/pca9555-1780070.pdf?src-supplier=Digi-Key; ComponentLink6URL: https://datasheet.ciiva.com/1495/1090559-1495945.pdf?src-supplier=Element14; ComponentLink6Description: https://datasheet.ciiva.com/1495/1090559-1495945.pdf?src-supplier=Element14; ComponentLink7URL: https://datasheet.ciiva.com/8122/pca9555-8122281.pdf?src-supplier=Avnet; ComponentLink7Description: https://datasheet.ciiva.com/8122/pca9555-8122281.pdf?src-supplier=Avnet; ComponentLink8URL: https://datasheet.ciiva.com/46381/1090559-46381881.pdf?src-supplier=Element14; ComponentLink8Description: https://datasheet.ciiva.com/46381/1090559-46381881.pdf?src-supplier=Element14; ComponentLink9URL: https://datasheet.ciiva.com/4826/pca9555-4826810.pdf?src-supplier=Mouser; ComponentLink9Description: https://datasheet.ciiva.com/4826/pca9555-4826810.pdf?src-supplier=Mouser; Supplier Part Number 1: 568-1058-1-ND

## Sheet [06] - Backlight LEDs.SchDoc: Backlight LEDs
size A3; Date: N.A.; ApprovedBy: N.A.; CheckedBy: N.A.; Author: N.A.; CompanyName: Johannes Berndorfer; DrawnBy: JBE; Organization: N.A.; Address1: Konrad Grefe Gasse 22; Address2: 1230 Wien; Address3: AUSTRIA; Address4: N.A.; DocumentNumber: 6; Revision: A; SheetNumber: 6; SheetTotal: 8; ProjectTitle: Berndo Keyboard Switchboard PCB; Reviewer: -; Time: N.A.; ImagePath: N.A.; Application_BuildNumber: N.A.
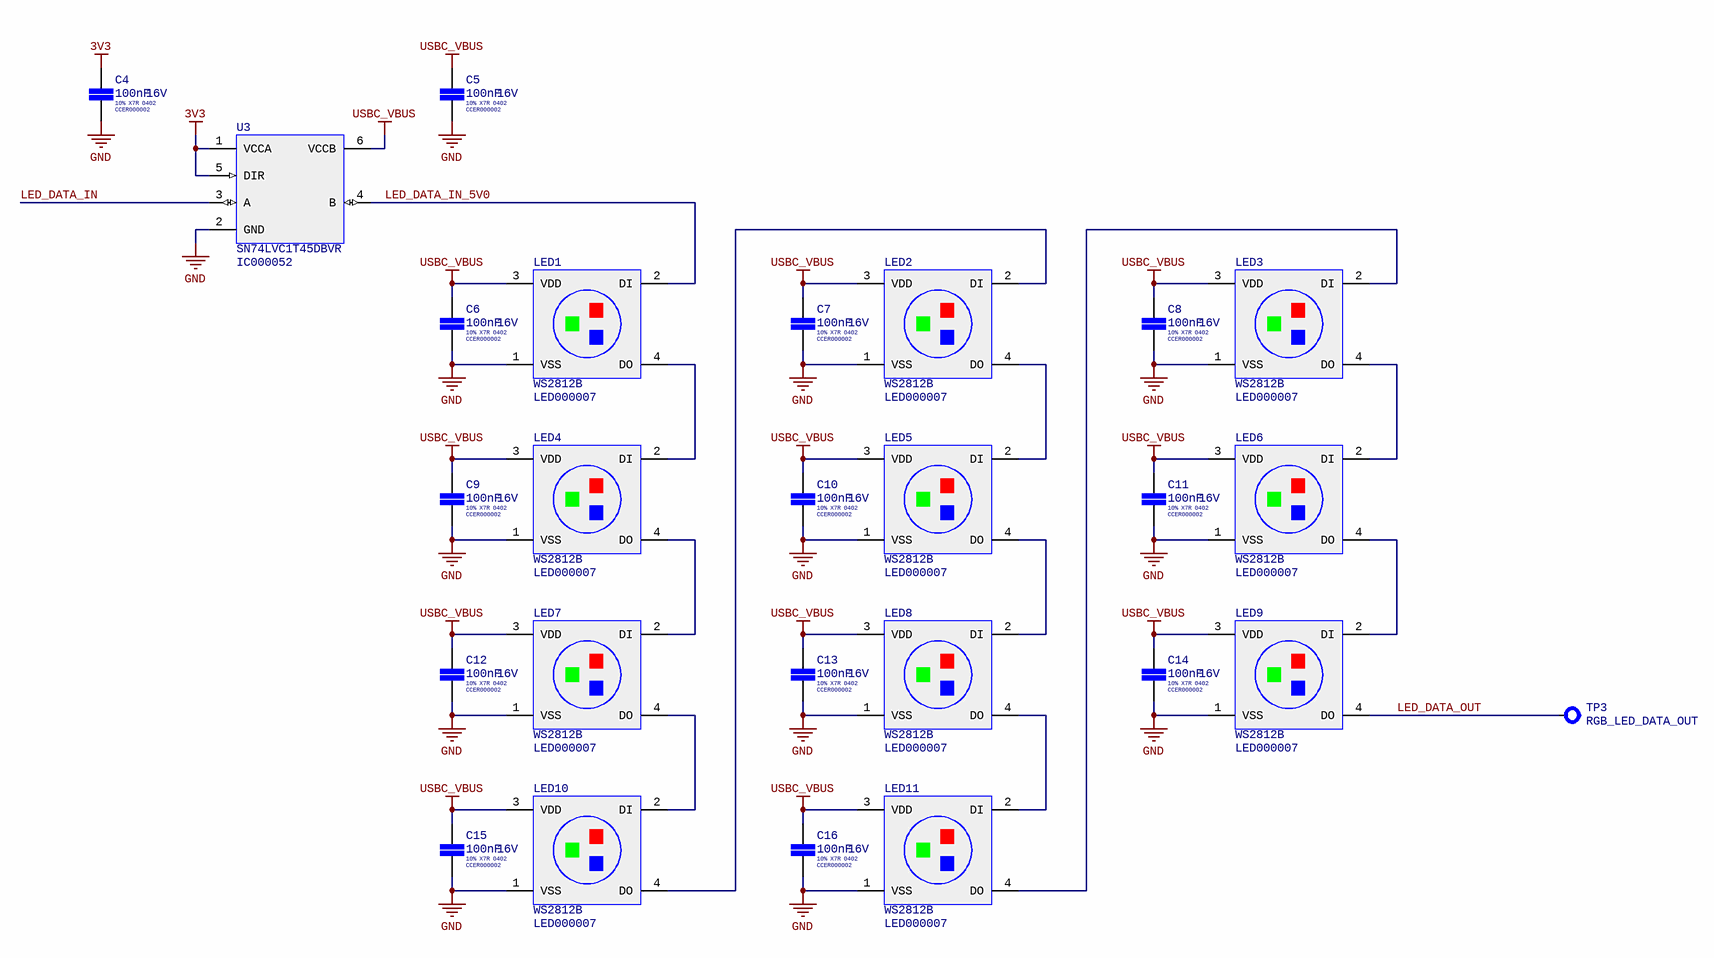
[diagram p5: [06] - Backlight LEDs.SchDoc]

### Parts
C4  Tolerance: 10%  Internal Part Number: CCER000002  Voltage Rating (DC): 16V  Dielectric: X7R  Case/Package: 0402  Capacitance: 100nF  [CAP-SMD-0402-0.55MM-IPC-MED]  (hidden comment: 100nF 16V)
C5  Tolerance: 10%  Internal Part Number: CCER000002  Voltage Rating (DC): 16V  Dielectric: X7R  Case/Package: 0402  Capacitance: 100nF  [CAP-SMD-0402-0.55MM-IPC-MED]  (hidden comment: 100nF 16V)
C6  Tolerance: 10%  Internal Part Number: CCER000002  Voltage Rating (DC): 16V  Dielectric: X7R  Case/Package: 0402  Capacitance: 100nF  [CAP-SMD-0402-0.55MM-IPC-MED]  (hidden comment: 100nF 16V)
C7  Tolerance: 10%  Internal Part Number: CCER000002  Voltage Rating (DC): 16V  Dielectric: X7R  Case/Package: 0402  Capacitance: 100nF  [CAP-SMD-0402-0.55MM-IPC-MED]  (hidden comment: 100nF 16V)
C8  Tolerance: 10%  Internal Part Number: CCER000002  Voltage Rating (DC): 16V  Dielectric: X7R  Case/Package: 0402  Capacitance: 100nF  [CAP-SMD-0402-0.55MM-IPC-MED]  (hidden comment: 100nF 16V)
C9  Tolerance: 10%  Internal Part Number: CCER000002  Voltage Rating (DC): 16V  Dielectric: X7R  Case/Package: 0402  Capacitance: 100nF  [CAP-SMD-0402-0.55MM-IPC-MED]  (hidden comment: 100nF 16V)
C10  Tolerance: 10%  Internal Part Number: CCER000002  Voltage Rating (DC): 16V  Dielectric: X7R  Case/Package: 0402  Capacitance: 100nF  [CAP-SMD-0402-0.55MM-IPC-MED]  (hidden comment: 100nF 16V)
C11  Tolerance: 10%  Internal Part Number: CCER000002  Voltage Rating (DC): 16V  Dielectric: X7R  Case/Package: 0402  Capacitance: 100nF  [CAP-SMD-0402-0.55MM-IPC-MED]  (hidden comment: 100nF 16V)
C12  Tolerance: 10%  Internal Part Number: CCER000002  Voltage Rating (DC): 16V  Dielectric: X7R  Case/Package: 0402  Capacitance: 100nF  [CAP-SMD-0402-0.55MM-IPC-MED]  (hidden comment: 100nF 16V)
C13  Tolerance: 10%  Internal Part Number: CCER000002  Voltage Rating (DC): 16V  Dielectric: X7R  Case/Package: 0402  Capacitance: 100nF  [CAP-SMD-0402-0.55MM-IPC-MED]  (hidden comment: 100nF 16V)
C14  Tolerance: 10%  Internal Part Number: CCER000002  Voltage Rating (DC): 16V  Dielectric: X7R  Case/Package: 0402  Capacitance: 100nF  [CAP-SMD-0402-0.55MM-IPC-MED]  (hidden comment: 100nF 16V)
C15  Tolerance: 10%  Internal Part Number: CCER000002  Voltage Rating (DC): 16V  Dielectric: X7R  Case/Package: 0402  Capacitance: 100nF  [CAP-SMD-0402-0.55MM-IPC-MED]  (hidden comment: 100nF 16V)
C16  Tolerance: 10%  Internal Part Number: CCER000002  Voltage Rating (DC): 16V  Dielectric: X7R  Case/Package: 0402  Capacitance: 100nF  [CAP-SMD-0402-0.55MM-IPC-MED]  (hidden comment: 100nF 16V)
LED1  WS2812B  Internal Part Number: LED000007  [LED-SMD-4-SMD-5050-WS2812B]
LED2  WS2812B  Internal Part Number: LED000007  [LED-SMD-4-SMD-5050-WS2812B]
LED3  WS2812B  Internal Part Number: LED000007  [LED-SMD-4-SMD-5050-WS2812B]
LED4  WS2812B  Internal Part Number: LED000007  [LED-SMD-4-SMD-5050-WS2812B]
LED5  WS2812B  Internal Part Number: LED000007  [LED-SMD-4-SMD-5050-WS2812B]
LED6  WS2812B  Internal Part Number: LED000007  [LED-SMD-4-SMD-5050-WS2812B]
LED7  WS2812B  Internal Part Number: LED000007  [LED-SMD-4-SMD-5050-WS2812B]
LED8  WS2812B  Internal Part Number: LED000007  [LED-SMD-4-SMD-5050-WS2812B]
LED9  WS2812B  Internal Part Number: LED000007  [LED-SMD-4-SMD-5050-WS2812B]
LED10  WS2812B  Internal Part Number: LED000007  [LED-SMD-4-SMD-5050-WS2812B]
LED11  WS2812B  Internal Part Number: LED000007  [LED-SMD-4-SMD-5050-WS2812B]
TP3  RGB_LED_DATA_OUT  [TP-SMD-CIRCULAR-1MM]
U3  SN74LVC1T45DBVR  Internal Part Number: IC000052  [SOT-23-6-H1.45MM-TI]

### Nets
3V3: C4.1 U3.1(VCCA) U3.5(DIR)
GND: C4.2 C5.2 C6.2 C7.2 C8.2 C9.2 C10.2 C11.2 C12.2 C13.2 C14.2 C15.2 C16.2 LED1.1(VSS) LED2.1(VSS) LED3.1(VSS) LED4.1(VSS) LED5.1(VSS) LED6.1(VSS) LED7.1(VSS) LED8.1(VSS) LED9.1(VSS) LED10.1(VSS) LED11.1(VSS) U3.2(GND)
USBC_VBUS: C5.1 C6.1 C7.1 C8.1 C9.1 C10.1 C11.1 C12.1 C13.1 C14.1 C15.1 C16.1 LED1.3(VDD) LED2.3(VDD) LED3.3(VDD) LED4.3(VDD) LED5.3(VDD) LED6.3(VDD) LED7.3(VDD) LED8.3(VDD) LED9.3(VDD) LED10.3(VDD) LED11.3(VDD) U3.6(VCCB)
LED_DATA_IN: U3.3(A)
LED_DATA_IN_5V0: LED1.2(DI) U3.4(B)
LED_DATA_OUT: LED9.4(DO) TP3.1
NetLED1_4: LED1.4(DO) LED4.2(DI)
NetLED2_2: LED2.2(DI) LED10.4(DO)
NetLED2_4: LED2.4(DO) LED5.2(DI)
NetLED3_2: LED3.2(DI) LED11.4(DO)
NetLED3_4: LED3.4(DO) LED6.2(DI)
NetLED4_4: LED4.4(DO) LED7.2(DI)
NetLED5_4: LED5.4(DO) LED8.2(DI)
NetLED6_4: LED6.4(DO) LED9.2(DI)
NetLED7_4: LED7.4(DO) LED10.2(DI)
NetLED8_4: LED8.4(DO) LED11.2(DI)

### Notes on the sheet
- Title:
- Project:
- Document Nr.:
- Revision:
- Date:
- Drawn By:
- Time:
- Reviewed By:
- Sheet
- of
- Size:
- A3
- Variant:
- File:

### Library data of the parts
C4-C16 = CL05B104KO5NNNC: CAP CER 100N 16V X7R 10% SMD 0402 125C SAMSUNG; Material: Ceramic; Supplier 1: Digi-Key; Manufacturer 1: Samsung; Manufacturer Part Number 1: CL05B104KO5NNNC; Stock 1: 53930414; Pricing 1: 1=0,10000, 10=0,02400, 100=0,01070, 500=0,00766, 1000=0,00602, 2500=0,00548, 5000=0,00504 (USD); RoHS: Yes; Mount: Surface Mount; Case Code (Metric): 1005; Case Code (Imperial): 0402; Contact Plating: Tin; Min Operating Temperature: -55°C; Max Operating Temperature: 125°C; Package Quantity: 1; Packaging: Tape and Reel; Voltage Rating: 16V; Voltage: 16V; Length: 1mm; Height: 0.5mm; Width: 0.02inch; Thickness: 0.022inch; Depth: 0.5mm; Radiation Hardening: No; Lead Free: Lead Free; ComponentLink1URL: https://datasheet.ciiva.com/26920/getdatasheetpartid-359683-26920169.pdf?src-supplier=Verical; ComponentLink1Description: https://datasheet.ciiva.com/26920/getdatasheetpartid-359683-26920169.pdf?src-supplier=Verical; ComponentLink2URL: https://datasheet.ciiva.com/29198/458718-da-01-en-vs-kondensator-0402-29198423.pdf?src-supplier=Conrad; ComponentLink2Description: https://datasheet.ciiva.com/29198/458718-da-01-en-vs-kondensator-0402-29198423.pdf?src-supplier=Conrad; ComponentLink3URL: https://datasheet.ciiva.com/16208/cl05b104kq5nnnc-16208343.pdf?src-supplier=Future+Electronics; ComponentLink3Description: https://datasheet.ciiva.com/16208/cl05b104kq5nnnc-16208343.pdf?src-supplier=Future+Electronics; ComponentLink4URL: https://datasheet.ciiva.com/26309/mlcc-catalogdownload2013-eng-26309003.pdf?src-supplier=Distrelec; ComponentLink4Description: https://datasheet.ciiva.com/26309/mlcc-catalogdownload2013-eng-26309003.pdf?src-supplier=Distrelec; Supplier Part Number 1: 1276-1001-6-ND
LED1-LED11 = WS2812B: LED RGB-ADDRESSABLE SERIAL 5050
TP3 = TESTPOINT_CIRCULAR_1MM
U3 = SN74LVC1T45DBVR: IC LEVEL SHIFTER BIDIR TRISTATE 1CH SOT-23-6 1V65-5V5; Manufacturer: Texas Instruments; Number of Elements: 1; Direction: Bidirectional; Propagation Delay: 3.9ns; Max Supply Voltage: 5.5V; Min Supply Voltage: 1.65V; Data Rate: 420Mbps; Logic Function: Translator,Transceiver; High Level Output Current: -32mA; Low Level Output Current: 32mA; Polarity: Non-Inverting; Turn-On Delay Time: 36.2ns; Quiescent Current: 3uA; Supplier 1: Digi-Key; Manufacturer Part Number: SN74LVC1T45DBVR; Stock 1: 70407; Pricing 1: 1 = 0,60000, 10 = 0,51000, 100 = 0,38070, 500 = 0,29912, 1000 = 0,23113 (USD); RoHS: Yes; Mount: Surface Mount; Case/Package: SOT-23; Number of Pins: 6; Weight: 0.000229oz; Contact Plating: Gold; Min Operating Temperature: -40°C; Max Operating Temperature: 85°C; Packaging: Tape and Reel; Package Quantity: 3000; Number of Channels: 1; Number of Inputs: 1; Number of Bits: 1; Length: 3.05mm; Height: 1.75mm; Width: 1.3mm; Radiation Hardening: No; REACH SVHC: No SVHC; Lead Free: Lead Free; ComponentLink1URL: https://datasheet.ciiva.com/27055/2000549-27055985.pdf?src-supplier=Jameco; ComponentLink1Description: https://datasheet.ciiva.com/27055/2000549-27055985.pdf?src-supplier=Jameco; ComponentLink2URL: https://datasheet.ciiva.com/23943/1772421-23943378.pdf?src-supplier=Newark; ComponentLink2Description: https://datasheet.ciiva.com/23943/1772421-23943378.pdf?src-supplier=Newark; ComponentLink3URL: https://datasheet.ciiva.com/15086/getdatasheetpartid-309359-15086627.pdf?src-supplier=Verical; ComponentLink3Description: https://datasheet.ciiva.com/15086/getdatasheetpartid-309359-15086627.pdf?src-supplier=Verical; ComponentLink4URL: https://datasheet.ciiva.com/7293/1862463-7293669.pdf?src-supplier=Newark; ComponentLink4Description: https://datasheet.ciiva.com/7293/1862463-7293669.pdf?src-supplier=Newark; ComponentLink5URL: https://datasheet.ciiva.com/1899/sn74lvc1t45-1899260.pdf?src-supplier=Digi-Key; ComponentLink5Description: https://datasheet.ciiva.com/1899/sn74lvc1t45-1899260.pdf?src-supplier=Digi-Key; ComponentLink6URL: https://datasheet.ciiva.com/1899/sn74lvc1t45-1899261.pdf?src-supplier=Digi-Key; ComponentLink6Description: https://datasheet.ciiva.com/1899/sn74lvc1t45-1899261.pdf?src-supplier=Digi-Key; ComponentLink7URL: https://datasheet.ciiva.com/25973/sn74lvc1t45-25973997.pdf?src-supplier=Avnet+Europe; ComponentLink7Description: https://datasheet.ciiva.com/25973/sn74lvc1t45-25973997.pdf?src-supplier=Avnet+Europe; ComponentLink8URL: https://datasheet.ciiva.com/1899/sn74lvc1t45-1899262.pdf?src-supplier=Digi-Key; ComponentLink8Description: https://datasheet.ciiva.com/1899/sn74lvc1t45-1899262.pdf?src-supplier=Digi-Key; Supplier Part Number 1: 296-16843-1-ND

## Sheet [07] - USB-C Connector.SchDoc: USB-C Connector
size A3; Date: N.A.; ApprovedBy: N.A.; CheckedBy: N.A.; Author: N.A.; CompanyName: Johannes Berndorfer; DrawnBy: JBE; Organization: N.A.; Address1: Konrad Grefe Gasse 22; Address2: 1230 Wien; Address3: AUSTRIA; Address4: N.A.; DocumentNumber: 7; Revision: A; SheetNumber: 7; SheetTotal: 8; ProjectTitle: Berndo Keyboard Switchboard PCB; Reviewer: -; Time: N.A.; ImagePath: N.A.; Application_BuildNumber: N.A.
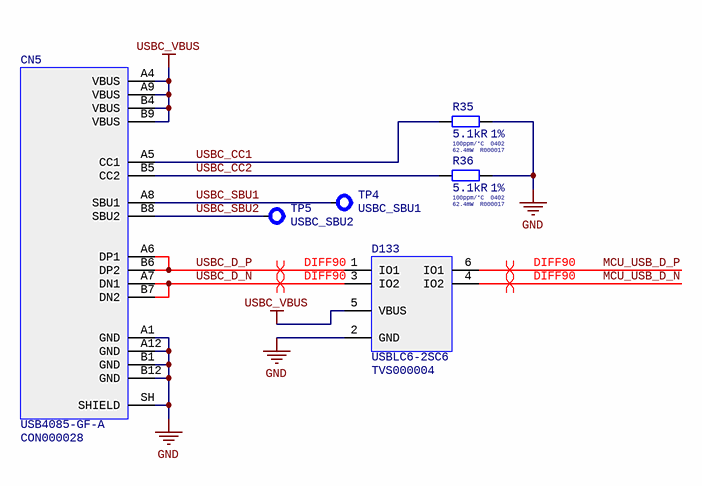
[diagram p6: [07] - USB-C Connector.SchDoc]

### Parts
CN5  USB4085-GF-A  Internal Part Number: CON000028  [CON-THT-USB-C-16POS-USB4085-GCT]
D133  USBLC6-2SC6  Internal Part Number: TVS000004  [SOT-23-6L-H1.45MM-ST]
R35  Case/Package: 0402  Resistance: 5.1kR  Temperature Coefficient: 100ppm/°C  Tolerance: 1%  Max Power Dissipation: 62.4mW  Internal Part Number: R000017  [RES-SMD-0402-0.4MM-IPC-MED]  (hidden comment: RC0402FR-075K1L)
R36  Case/Package: 0402  Resistance: 5.1kR  Temperature Coefficient: 100ppm/°C  Tolerance: 1%  Max Power Dissipation: 62.4mW  Internal Part Number: R000017  [RES-SMD-0402-0.4MM-IPC-MED]  (hidden comment: RC0402FR-075K1L)
TP4  USBC_SBU1  [TP-SMD-CIRCULAR-1MM]
TP5  USBC_SBU2  [TP-SMD-CIRCULAR-1MM]

### Nets
GND: CN5.A1(GND) CN5.A12(GND) CN5.B1(GND) CN5.B12(GND) CN5.SH(SHIELD) D133.2(GND) R35.2 R36.2
USBC_VBUS: CN5.A4(VBUS) CN5.A9(VBUS) CN5.B4(VBUS) CN5.B9(VBUS) D133.5(VBUS)
MCU_USB_D_N: D133.4(IO2)
MCU_USB_D_P: D133.6(IO1)
USBC_CC1: CN5.A5(CC1) R35.1
USBC_CC2: CN5.B5(CC2) R36.1
USBC_D_N: CN5.A7(DN1) CN5.B7(DN2) D133.3(IO2)
USBC_D_P: CN5.A6(DP1) CN5.B6(DP2) D133.1(IO1)
USBC_SBU1: CN5.A8(SBU1) TP4.1
USBC_SBU2: CN5.B8(SBU2) TP5.1

### Layout directives
differential pair; differential pair class DIFF90: MCU_USB_D_N, MCU_USB_D_P, USBC_D_N, USBC_D_P

### Notes on the sheet
- Title:
- Project:
- Document Nr.:
- Revision:
- Date:
- Drawn By:
- Time:
- Reviewed By:
- Sheet
- of
- Size:
- A3
- Variant:
- File:

### Library data of the parts
CN5 = USB4085-GF-A: CON USB TYPE C THROUGH HOLE 16POS; Manufacturer: Global Connector Technology; USB Standard: USB 2.0; Gender: Receptacle; Number of Positions: 16; Supplier 1: Digi-Key; Manufacturer Part Number: USB4085-GF-A; Stock 1: 0; RoHS: No; Contact Material: Copper Alloy; Contact Plating: Gold; Orientation: Right Angle; ComponentLink1URL: https://datasheet.ciiva.com/71788/2674755-71788146.pdf?src-supplier=Element14; ComponentLink1Description: https://datasheet.ciiva.com/71788/2674755-71788146.pdf?src-supplier=Element14; ComponentLink2URL: https://datasheet.ciiva.com/71788/usb4085-71788147.pdf?src-supplier=Digi-Key; ComponentLink2Description: https://datasheet.ciiva.com/71788/usb4085-71788147.pdf?src-supplier=Digi-Key; Supplier Part Number 1: 2073-USB4085-GF-ACT-ND
D133 = USBLC6-2SC6: TVS DIODE 2CH 5.25V 17V USB2.0 SOT23-6L; Manufacturer: STMicroelectronics; Data Rate: 480Mbps; Direction: Unidirectional,Bidirectional; Capacitance: 3.5pF; Operating Supply Voltage: 1.1V; Number of Elements: 1; Number of Channels: 2; Reverse Breakdown Voltage: 6V; Working Voltage: 5V; Power Line Protection: Yes; Test Current: 1mA; Max Reverse Leakage Current: 150nA; Peak Pulse Current: 5A; Element Configuration: Dual; Supplier 1: Digi-Key; Manufacturer Part Number: USBLC6-2SC6; Stock 1: 30680; Pricing 1: 1 = 0,47000, 10 = 0,39900, 100 = 0,29820, 500 = 0,23430, 1000 = 0,18105 (USD); RoHS: Yes; Mount: Surface Mount; Case/Package: SOT-23; Number of Pins: 6; Contact Plating: Tin,Matte; Min Operating Temperature: -40°C; Max Operating Temperature: 125°C; Packaging: Tape and Reel; Package Quantity: 3000; Polarity: Unidirectional,Bidirectional; Breakdown Voltage: 6V; Clamping Voltage: 17V; Termination: SMD/SMT; Number of Bidirectional Channels: 2; Reverse Standoff Voltage: 5.25V; Min Breakdown Voltage: 6V; ESD Protection: Yes; Max Breakdown Voltage: 6V; Leakage Current: 150nA; Length: 3.05mm; Height: 1.3mm; Width: 1.75mm; Depth: 1.75mm; Radiation Hardening: No; REACH SVHC: No SVHC; Lead Free: Lead Free; ComponentLink1URL: https://datasheet.ciiva.com/1268/1690354-1268384.pdf?src-supplier=Element14; ComponentLink1Description: https://datasheet.ciiva.com/1268/1690354-1268384.pdf?src-supplier=Element14; ComponentLink2URL: https://datasheet.ciiva.com/4508/cd00050750-113117-4508433.pdf?src-supplier=Mouser; ComponentLink2Description: https://datasheet.ciiva.com/4508/cd00050750-113117-4508433.pdf?src-supplier=Mouser; ComponentLink3URL: https://datasheet.ciiva.com/26787/usblc6-2sc6-26787908.pdf?src-supplier=IIIC; ComponentLink3Description: https://datasheet.ciiva.com/26787/usblc6-2sc6-26787908.pdf?src-supplier=IIIC; ComponentLink4URL: https://datasheet.ciiva.com/16200/cd00050750-16200026.pdf?src-supplier=Future+Electronics; ComponentLink4Description: https://datasheet.ciiva.com/16200/cd00050750-16200026.pdf?src-supplier=Future+Electronics; Supplier Part Number 1: 497-5235-1-ND
R35 R36 = RC0402FR-075K1L: RES 5K1 1% 1/16W SMD 0402 YAEGO; Manufacturer: Yageo; Power Rating: 63mW; Voltage Rating: 50V; Supplier 1: Digi-Key; Manufacturer Part Number: RC0402FR-075K1L; Stock 1: 3098997; Pricing 1: 1 = 0,10000, 10 = 0,01600, 100 = 0,00640, 1000 = 0,00289, 2500 = 0,00251, 5000 = 0,00207 (USD); RoHS: Yes; Case Code (Metric): 1005; Case Code (Imperial): 0402; Min Operating Temperature: -55°C; Max Operating Temperature: 155°C; Packaging: Tape and Reel; Package Quantity: 1; Composition: Thick Film; Number of Terminations: 2; Termination: SMD/SMT; Military Standard: Not; Voltage Rating (DC): 50V; Features: Moisture Resistant; Working Voltage: 50V; Length: 1mm; Height: 0.016inch; Width: 0.02inch; Depth: 0.5mm; REACH SVHC: Unknown; Lead Free: Lead Free; ComponentLink1URL: https://datasheet.ciiva.com/15189/getdatasheetpartid-323636-15189493.pdf?src-supplier=Verical; ComponentLink1Description: https://datasheet.ciiva.com/15189/getdatasheetpartid-323636-15189493.pdf?src-supplier=Verical; ComponentLink2URL: https://datasheet.ciiva.com/2453/pyu-r-int-thick-7-2453400.pdf?src-supplier=Digi-Key; ComponentLink2Description: https://datasheet.ciiva.com/2453/pyu-r-int-thick-7-2453400.pdf?src-supplier=Digi-Key; ComponentLink3URL: https://datasheet.ciiva.com/46394/1018594-46394936.pdf?src-supplier=Element14; ComponentLink3Description: https://datasheet.ciiva.com/46394/1018594-46394936.pdf?src-supplier=Element14; ComponentLink4URL: https://datasheet.ciiva.com/2453/pyu-r-int-thick-7-2453401.pdf?src-supplier=Digi-Key; ComponentLink4Description: https://datasheet.ciiva.com/2453/pyu-r-int-thick-7-2453401.pdf?src-supplier=Digi-Key; ComponentLink5URL: https://datasheet.ciiva.com/2453/pyu-r-int-thick-7-2453402.pdf?src-supplier=Digi-Key; ComponentLink5Description: https://datasheet.ciiva.com/2453/pyu-r-int-thick-7-2453402.pdf?src-supplier=Digi-Key; ComponentLink6URL: https://datasheet.ciiva.com/16744/pyu-rc0402-51-rohs-l-6-r-16744283.pdf?src-supplier=Future+Electronics; ComponentLink6Description: https://datasheet.ciiva.com/16744/pyu-rc0402-51-rohs-l-6-r-16744283.pdf?src-supplier=Future+Electronics; ComponentLink7URL: https://datasheet.ciiva.com/12558/pyu-rc0402-51-rohs-l-6-r-8721-12558460.pdf?src-supplier=Mouser; ComponentLink7Description: https://datasheet.ciiva.com/12558/pyu-rc0402-51-rohs-l-6-r-8721-12558460.pdf?src-supplier=Mouser; ComponentLink8URL: https://datasheet.ciiva.com/7983/1018594-7983519.pdf?src-supplier=Element14; ComponentLink8Description: https://datasheet.ciiva.com/7983/1018594-7983519.pdf?src-supplier=Element14; Supplier Part Number 1: 311-5.10KLRCT-ND
TP4 TP5 = TESTPOINT_CIRCULAR_1MM